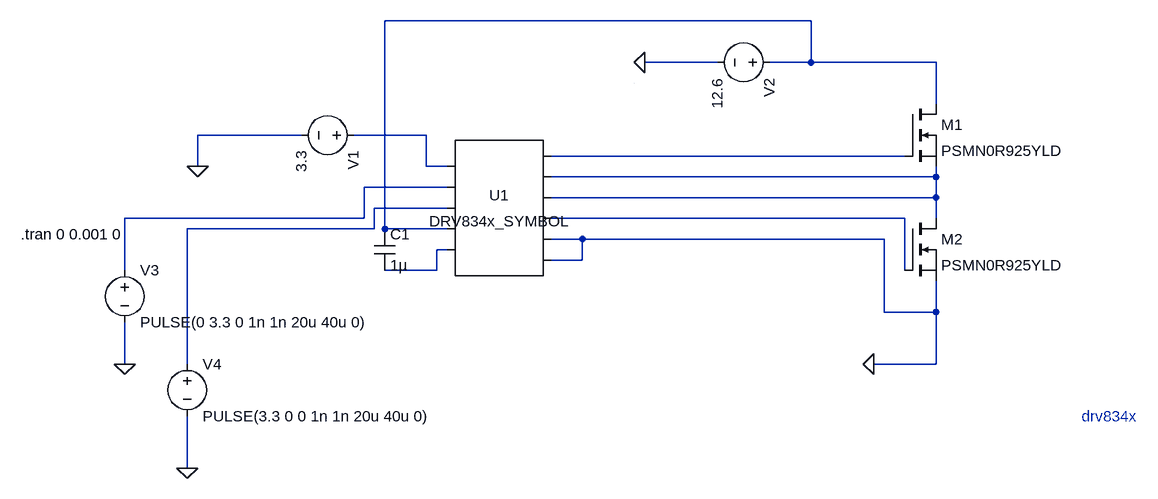
[diagram p0: schematic SimpleSim.asc]
SimpleSim.asc, the LTspice schematic file:
Version 4
SHEET 1 1308 740
WIRE 272 -96 -384 -96
WIRE 128 -32 16 -32
WIRE 272 -32 272 -96
WIRE 272 -32 208 -32
WIRE 464 -32 272 -32
WIRE 464 32 464 -32
WIRE -512 80 -672 80
WIRE -320 80 -432 80
WIRE 416 112 -128 112
WIRE -672 128 -672 80
WIRE -320 128 -320 80
WIRE -288 128 -320 128
WIRE 464 144 464 128
WIRE 464 144 -128 144
WIRE -288 160 -416 160
WIRE 464 176 464 144
WIRE 464 176 -128 176
WIRE -288 192 -400 192
WIRE -416 208 -416 160
WIRE -416 208 -784 208
WIRE 416 208 -128 208
WIRE 464 208 464 176
WIRE -400 224 -400 192
WIRE -400 224 -688 224
WIRE -384 224 -384 -96
WIRE -288 224 -384 224
WIRE -80 240 -128 240
WIRE 384 240 -80 240
WIRE -288 256 -304 256
WIRE -80 272 -80 240
WIRE -80 272 -128 272
WIRE -784 288 -784 208
WIRE -304 288 -304 256
WIRE -304 288 -384 288
WIRE 416 288 416 208
WIRE 384 352 384 240
WIRE 464 352 464 304
WIRE 464 352 384 352
WIRE -784 432 -784 368
WIRE -688 432 -688 224
WIRE 464 432 464 352
WIRE 464 432 368 432
WIRE -688 592 -688 512
WIRE 0 0 0 0
FLAG 368 432 0
FLAG -688 592 0
FLAG 16 -32 0
FLAG -784 432 0
FLAG -672 128 0
SYMBOL nmos 416 32 R0
SYMATTR InstName M1
SYMATTR Value PSMN0R925YLD
SYMBOL nmos 416 208 R0
SYMATTR InstName M2
SYMATTR Value PSMN0R925YLD
SYMBOL voltage -416 80 R90
WINDOW 123 0 0 Left 0
WINDOW 39 0 0 Left 0
SYMATTR InstName V1
SYMATTR Value 3.3
SYMBOL voltage 224 -32 R90
WINDOW 123 0 0 Left 0
WINDOW 39 0 0 Left 0
SYMATTR InstName V2
SYMATTR Value 12.6
SYMBOL voltage -688 416 R0
WINDOW 123 0 0 Left 0
WINDOW 39 0 0 Left 0
SYMATTR InstName V4
SYMATTR Value PULSE(3.3 0 0 1n 1n 20u 40u 0)
SYMBOL AutoGenerated\\DRV834x_SYMBOL -208 192 R0
SYMATTR InstName U1
SYMBOL cap -400 224 R0
SYMATTR InstName C1
SYMATTR Value 1µ
SYMBOL voltage -784 272 R0
WINDOW 123 0 0 Left 0
WINDOW 39 0 0 Left 0
SYMATTR InstName V3
SYMATTR Value PULSE(0 3.3 0 1n 1n 20u 40u 0)
TEXT -944 232 Left 2 !.tran 0 0.001 0
TEXT 688 512 Left 2 ;drv834x

The netlist it stands for:
* SimpleSim.asc
M1 N001 N003 N004 N004 PSMN0R925YLD
M2 N004 N007 0 0 PSMN0R925YLD
V1 N002 0 3.3
V2 N001 0 12.6
V4 N006 0 PULSE(3.3 0 0 1n 1n 20u 40u 0)
* U1: DRV834x_SYMBOL (symbol AutoGenerated\DRV834x_SYMBOL not available, pins judged from their places): pin1=N002 pin2=N005 pin3=N006 pin4=N001 pin5=N008 pin6=N003 pin7=N004 pin8=N004 pin9=N007 pin10=0 pin11=0
C1 N001 N008 1µ
V3 N005 0 PULSE(0 3.3 0 1n 1n 20u 40u 0)
.model NMOS NMOS
.model PMOS PMOS
.lib standard.mos
.tran 0 0.001 0
* drv834x
.backanno
.end